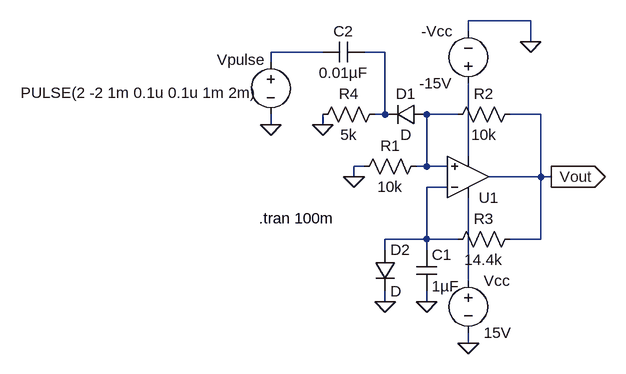
[diagram p0: schematic Q3.asc]
Q3.asc, the LTspice schematic file:
Version 4
SHEET 1 880 680
WIRE 304 -112 208 -112
WIRE 208 -96 208 -112
WIRE 304 -80 304 -112
WIRE -16 -64 -96 -64
WIRE 80 -64 48 -64
WIRE -96 -48 -96 -64
WIRE 80 32 80 -64
WIRE 80 32 64 32
WIRE 144 32 128 32
WIRE 192 32 144 32
WIRE 320 32 272 32
WIRE -96 48 -96 32
WIRE -16 48 -16 32
WIRE 208 96 208 -16
WIRE 48 112 32 112
WIRE 144 112 144 32
WIRE 144 112 128 112
WIRE 176 112 144 112
WIRE 32 128 32 112
WIRE 320 128 320 32
WIRE 320 128 240 128
WIRE 336 128 320 128
WIRE 176 144 144 144
WIRE 144 224 144 144
WIRE 144 224 80 224
WIRE 192 224 144 224
WIRE 320 224 320 128
WIRE 320 224 272 224
WIRE 80 240 80 224
WIRE 144 240 144 224
WIRE 208 288 208 160
WIRE 80 320 80 304
WIRE 144 320 144 304
WIRE 208 384 208 368
FLAG 336 128 Vout
IOPIN 336 128 Out
FLAG -16 48 0
FLAG 32 128 0
FLAG 80 320 0
FLAG 144 320 0
FLAG 304 -80 0
FLAG 208 384 0
FLAG -96 48 0
SYMBOL Opamps\\UniversalOpamp2 208 128 M180
SYMATTR InstName U1
SYMBOL diode 144 16 R90
WINDOW 0 0 32 VBottom 2
WINDOW 3 32 32 VTop 2
SYMATTR InstName D1
SYMBOL res 144 96 R90
WINDOW 0 0 56 VBottom 2
WINDOW 3 32 56 VTop 2
SYMATTR InstName R1
SYMATTR Value 10k
SYMBOL res 288 16 R90
WINDOW 0 0 56 VBottom 2
WINDOW 3 32 56 VTop 2
SYMATTR InstName R2
SYMATTR Value 10k
SYMBOL res 288 208 R90
WINDOW 0 0 56 VBottom 2
WINDOW 3 32 56 VTop 2
SYMATTR InstName R3
SYMATTR Value 14.4k
SYMBOL res 80 16 R90
WINDOW 0 0 56 VBottom 2
WINDOW 3 32 56 VTop 2
SYMATTR InstName R4
SYMATTR Value 5k
SYMBOL cap 128 240 R0
SYMATTR InstName C1
SYMATTR Value 1µF
SYMBOL cap 48 -80 R90
WINDOW 0 0 32 VBottom 2
WINDOW 3 32 32 VTop 2
SYMATTR InstName C2
SYMATTR Value 0.01µF
SYMBOL diode 64 240 R0
SYMATTR InstName D2
SYMBOL voltage 208 272 R0
SYMATTR InstName Vcc
SYMATTR Value 15V
SYMBOL voltage 208 0 R180
WINDOW 0 24 96 Left 2
WINDOW 3 24 16 Left 2
SYMATTR InstName -Vcc
SYMATTR Value -15V
SYMBOL voltage -96 -64 R0
WINDOW 0 -83 12 Left 2
WINDOW 3 -385 63 Left 2
WINDOW 123 0 0 Left 0
WINDOW 39 0 0 Left 0
SYMATTR InstName Vpulse
SYMATTR Value PULSE(2 -2 1m 0.1u 0.1u 1m 2m)
TEXT -114 192 Left 2 !.tran 100m

The netlist it stands for:
* Q3.asc
XU1 N003 N005 N006 N004 Vout level.2 Avol=1Meg GBW=10Meg Slew=10Meg ilimit=25m rail=0 Vos=0 phimargin=45 en=0 enk=0 in=0 ink=0 Rin=500Meg  ; pins IN+ IN- V+ V- OUT
D1 N003 N002 D
R1 N003 0 10k
R2 Vout N003 10k
R3 Vout N005 14.4k
R4 N002 0 5k
C1 N005 0 1µF
C2 N002 N001 0.01µF
D2 N005 0 D
Vcc N006 0 15V
V§-Vcc N004 0 -15V
Vpulse N001 0 PULSE(2 -2 1m 0.1u 0.1u 1m 2m)
.model D D
.lib standard.dio
.tran 100m
.lib UniversalOpamps2.sub
.backanno
.end